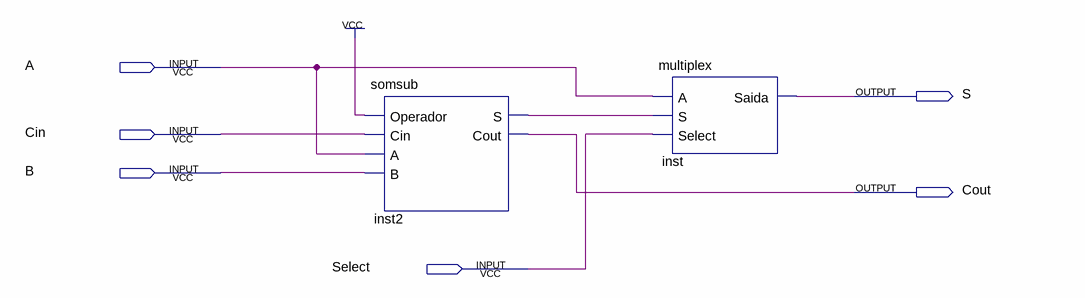
[diagram p0: schematic sheet]
// Quartus schematic div.bdf as structural Verilog: 2 symbols, 6 pins
module div (
  input  A,
  input  Cin,
  input  B,
  input  Select,
  output S,
  output Cout
);

  wire inst2_s;

  somsub inst2 (.Operador(1'b1), .Cin(Cin), .A(A), .B(B), .S(inst2_s), .Cout(Cout));
  multiplex inst (.A(A), .S(inst2_s), .Select(Select), .Saida(S));
endmodule
